# Altium project SmartHeat_Water_control.PrjPcb
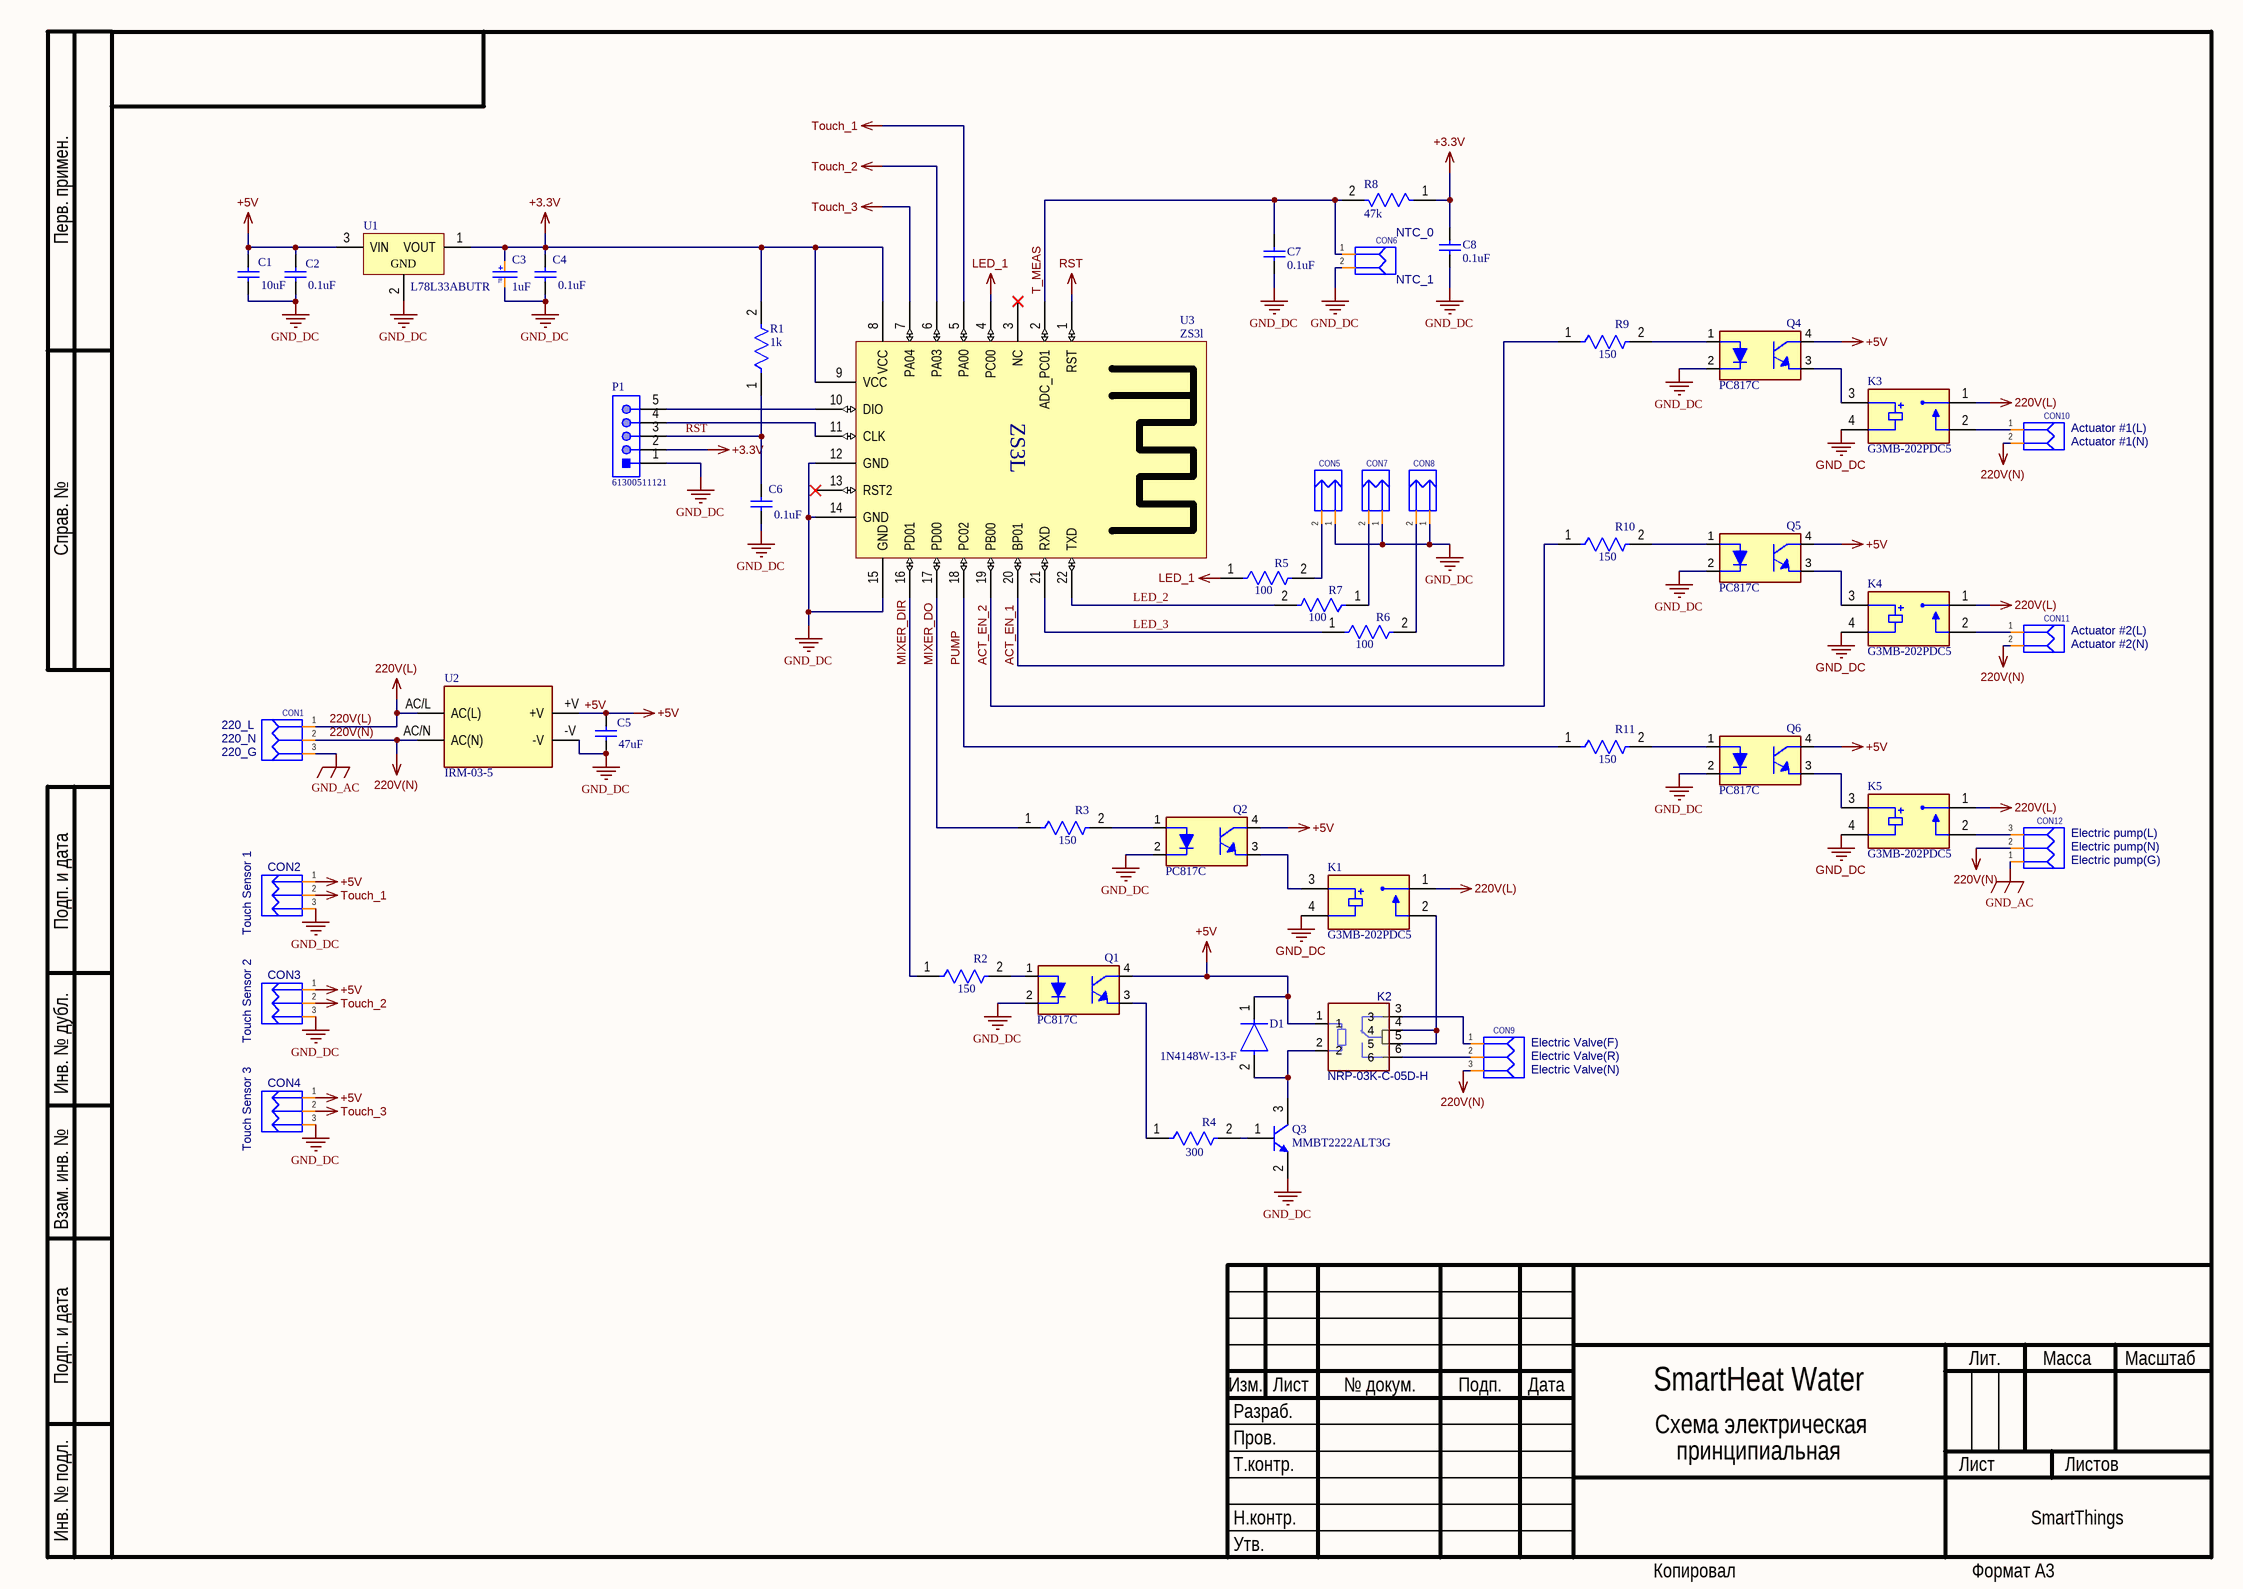
[diagram p0: Схема принципиальная.SchDoc]
1 sheet, 47 parts. Net scope: global (net labels, ports and power ports of the same name join across sheets).
Board file: Плата печатная2.PcbDoc

## Sheet Схема принципиальная.SchDoc
size 420 x 297 mm; Наименование организации: SmartThings; Наименование изделия 1: SmartHeat Water; Наименование изделия 2: Схема электрическая; Наименование изделия 3: принципиальная

### Parts
C1  10uF  [CAPC2013X135X45ML10T25]
C2  0.1uF  [CAPC2013X140X45NL15T25]
C3  1uF  [TANTAL_B]
C4  0.1uF  [CAPC2013X140X45NL15T25]
C5  47uF  [MURA-1210_H_2.7_L]
C6  0.1uF  [CAPC2013X140X45NL15T25]
C7  0.1uF  [CAPC2013X140X45NL15T25]
C8  0.1uF  [CAPC2013X140X45NL15T25]
CON1  DG129-5.08-3  [DG129-5.08-3]  (value not drawn)
CON2  PLS-03  [PLS-03]  (value not drawn)
CON3  PLS-03  [PLS-03]  (value not drawn)
CON4  PLS-03  [PLS-03]  (value not drawn)
CON5  PLS-02  [PLS-02]  (value not drawn)
CON6  DG129-5.08-2  [DG129-5.08-2]  (value not drawn)
CON7  PLS-02  [PLS-02]  (value not drawn)
CON8  PLS-02  [PLS-02]  (value not drawn)
CON9  DG129-5.08-3  [DG129-5.08-3]  (value not drawn)
CON10  DG129-5.08-2  [DG129-5.08-2]  (value not drawn)
CON11  DG129-5.08-2  [DG129-5.08-2]  (value not drawn)
CON12  DG129-5.08-3  [DG129-5.08-3]  (value not drawn)
D1  1N4148W-13-F  [FP-SOD123-MFG]
K1  G3MB-202PDC5  [RELAY_G3MB-202PDC5]
K2  NRP-03K-C-05D-H  [NRP-03K-C-05D-H]
K3  G3MB-202PDC5  [RELAY_G3MB-202PDC5]
K4  G3MB-202PDC5  [RELAY_G3MB-202PDC5]
K5  G3MB-202PDC5  [RELAY_G3MB-202PDC5]
P1  61300511121  [61300511121]
Q1  PC817C  [DIP762W50P254L650H458Q4B]
Q2  PC817C  [DIP762W50P254L650H458Q4B]
Q3  MMBT2222ALT3G  [ONSC-SOT-23-3-318-08_V]
Q4  PC817C  [DIP762W50P254L650H458Q4B]
Q5  PC817C  [DIP762W50P254L650H458Q4B]
Q6  PC817C  [DIP762W50P254L650H458Q4B]
R1  1k  [FP-CR0805-IPC_C]
R2  150  [FP-CR0805-IPC_C]
R3  150  [FP-CR0805-IPC_C]
R4  300  [FP-CR0805-IPC_C]
R5  100  [FP-CR0805-IPC_C]
R6  100  [FP-CR0805-IPC_C]
R7  100  [FP-CR0805-IPC_C]
R8  47k  [FP-CRCW1206-e3-IPC_C]
R9  150  [FP-CR0805-IPC_C]
R10  150  [FP-CR0805-IPC_C]
R11  150  [FP-CR0805-IPC_C]
U1  L78L33ABUTR  [SOT-89_L]
U2  IRM-03-5  [footprint_IRM-03-5]
U3  ZS3l  [zs3l]

### Nets
220V(L): CON1.1 K1.1 K3.1 K4.1 K5.1 U2.AC/L(AC(L))
220V(N): CON1.2 CON9.3 CON10.2 CON11.2 CON12.2 U2.AC/N(AC(N))
+3.3V: C3.1 C4.2 C8.2 P1.2 R1.2 R8.1 U1.1(VOUT) U3.8(VCC) U3.9(VCC)
+5V: C1.2 C2.2 C5.2 CON2.1 CON3.1 CON4.1 D1.1(C) K2.1 Q1.4 Q2.4 Q4.4 Q5.4 Q6.4 U1.3(VIN) U2.+V
GND_AC: CON1.3 CON12.1
GND_DC: C1.1 C2.1 C3.2 C4.1 C5.1 C6.1 C7.1 C8.1 CON2.3 CON3.3 CON4.3 CON5.1 CON6.2 CON7.1 CON8.1 K1.4 K3.4 K4.4 K5.4 P1.1 Q1.2 Q2.2 Q3.2(E) Q4.2 Q5.2 Q6.2 U1.2(GND) U2.-V U3.12(GND) U3.14(GND) U3.15(GND)
LED_1: R5.1 U3.4(PC00)
RST: C6.2 P1.3 R1.1 U3.1(RST)
Touch_1: CON2.2 U3.5(PA00)
Touch_2: CON3.2 U3.6(PA03)
Touch_3: CON4.2 U3.7(PA04)
ACT_EN_1: R9.1 U3.20(BP01)
ACT_EN_2: R10.1 U3.19(PB00)
LED_2: R7.2 U3.22(TXD)
LED_3: R6.1 U3.21(RXD)
MIXER_DIR: R2.1 U3.16(PD01)
MIXER_DO: R3.1 U3.17(PD00)
PUMP: R11.1 U3.18(PC02)
T_MEAS: C7.2 CON6.1 R8.2 U3.2(ADC_PC01)
NetCON5_2: CON5.2 R5.2
NetCON7_2: CON7.2 R7.1
NetCON8_2: CON8.2 R6.2
NetCON9_1: CON9.1 K2.3
NetCON9_2: CON9.2 K2.6
NetCON10_1: CON10.1 K3.2
NetCON11_1: CON11.1 K4.2
NetCON12_3: CON12.3 K5.2
NetD1_2: D1.2(A) K2.2 Q3.3(C)
NetK1_2: K1.2 K2.4 K2.5
NetK1_3: K1.3 Q2.3
NetK3_3: K3.3 Q4.3
NetK4_3: K4.3 Q5.3
NetK5_3: K5.3 Q6.3
NetP1_4: P1.4 U3.11(CLK)
NetP1_5: P1.5 U3.10(DIO)
NetQ1_1: Q1.1 R2.2
NetQ1_3: Q1.3 R4.1
NetQ2_1: Q2.1 R3.2
NetQ3_1: Q3.1(B) R4.2
NetQ4_1: Q4.1 R9.2
NetQ5_1: Q5.1 R10.2
NetQ6_1: Q6.1 R11.2

Not connected (* = marked no-connect by the designer): U3 3(NC)* 13(RST2)*

### Notes on the sheet
- NTC_0
- (near CON6) NTC_1
- (near CON10) Actuator #1(L)
- (near CON10) Actuator #1(N)
- (near CON11) Actuator #2(L)
- (near CON11) Actuator #2(N)
- (near CON1) 220_L
- (near CON1) 220_N
- (near CON1) 220_G
- (near CON12) Electric pump(L)
- (near CON12) Electric pump(G)
- (near CON12) Electric pump(N)
- Touch Sensor 1
- Touch Sensor 2
- (near CON9) Electric Valve(F)
- (near CON9) Electric Valve(N)
- (near CON9) Electric Valve(R)
- Touch Sensor 3
- Перв. примен.
- Справ. №
- Подп. и дата
- Инв. № дубл.
- Взам. инв. №
- Разраб.
- Изм.
- Лист
- № докум.
- Подп.
- Дата
- Лит.
- Масса
- Масштаб
- Пров.
- Т.контр.
- Листов
- Инв. № подл.
- Утв.
- Н.контр.
- Копировал
- Формат А3
- (in symbol _TANTAL-B) TB
- (in symbol ZS3l) ZS3L

### Library data of the parts
C1 = CMP-2000-04946-1: GRM21BR61E106KA73L / 10uF, +/- 10%, 25 V, 0805; Manufacturer: Murata; Dielectric: X7R; Capacitance: 1µF; Rated Voltage: 16V; Package Description: 2-Pin Surface Mount Device, Body 2 x 1.25 mm; Datasheet Version: Mar-08; Package Reference: 805; Datasheet URL: https://datasheet.ciiva.com/34302/1858922-34302874.pdf; Case Size/Dimension: 0805; Tolerance (%): ±10%; Manufacturer URL: http://www.murata.com/
C2 C4 C6-C8 = CMP-2007-03401-1: GRM21BR71H104K / 0.1 мкФ X7R 10% 50В 0805; Part Number: GRM21BR71C475KA73L; Manufacturer: Murata
C3 = _TANTAL-B: TANTAL TECAP1/50V B, 10%; Note: Tantalum Capacitors; Lifetime @ Temp: 2000Hrs@105℃; Publisher: Catcatcat Electronics; website developer: http://catcatcat.d-lan.dp.ua/; Assembly type: Manual Part; Value: 1uF
C5 = CMP-2000-06362-1: Cap Ceramic, 47 uF, +/- 10%, -55 to 85 degC, 2-Pin SMD (1210), RoHS, Tape and Reel; Manufacturer: Murata; Catalog Drawings: GRMSeries_1210_2.5; Voltage Rating DC: 16V; Capacitance: 47µF; Product Training Modules: High-CapMultilayerCeramicCapacitors; Temperature Coefficient: X5R; Online Catalog: GRMSeries; Other Names: 490-6539-6; Lead Style: -; Datasheet URL: http://psearch.en.murata.com/capacitor/product/GRM32ER61C476KE15%23.pdf; Package Description: 2-Pin Surface Mount Device, Body 3.2 x 2.5 mm; Applications: GeneralPurpose; Thickness (Max): 0.106"(2.70mm); Operating Temperature: -55°C~85°C; Mounting Technology: SurfaceMount; Category: Capacitors; Package / Case: 1210(3225Metric); Mounting Type: SurfaceMount,MLCC; Ratings: -; Package Reference: 1210; Height - Seated (Max): -; Series: GRM; Lead Spacing: -; Family: CeramicCapacitors; Datasheet Version: 04/2016; Tolerance: ±10%; Size / Dimension: 0.126"Lx0.098"W(3.20mmx2.50mm); Packaging: Digi-Reel®; Voltage - Rated: 16V; Standard Package: 1; Features: -; Manufacturer URL: http://www.murata.com/
CON1 CON9 CON12 = DG129-5.08-3: Note: Connector; Temp.Characteristic: -40C to +85C; Value: *; Publisher: Catcatcat Electronics; Website developer: http://catcatcat.d-lan.dp.ua/; Assembly type: Manual Part
CON2-CON4 = PLS-03: 2.54 mm; Note: Connector; Temp.Characteristic: -40C to +85C; Value: *; Publisher: Catcatcat Electronics; Website developer: http://catcatcat.d-lan.dp.ua/; Assembly type: Manual Part
CON5 CON7 CON8 = PLS-02: 2.54 mm; Note: Connector; Temp.Characteristic: -40C to +85C; Value: *; Publisher: Catcatcat Electronics; Website developer: http://catcatcat.d-lan.dp.ua/; Assembly type: Manual Part
CON6 CON10 CON11 = DG129-5.08-2: Note: Connector; Temp.Characteristic: -40C to +85C; Value: *; Publisher: Catcatcat Electronics; Website developer: http://catcatcat.d-lan.dp.ua/; Assembly type: Manual Part
D1 = CMP-12791-000005-1: DIODE GEN PURP 100V 150MA SOD123; Manufacturer: Diodes Inc.; Capacitance: 2pF; Forward Current: 300mA; Max Junction Temp: +150°C; Value: 2pF; Standoff Height: 0mm; Peak Reverse Current: 1uA; Max Surge Forward Current: 1A; Category: Diode; Height: 1.45mm; ComponentLink2URL: https://upverter.com/datasheet/628e7d6fee5901eee6eef4567d1c3569f2cd3cde.pdf; Lead Free: Yes; ComponentLink2Description: Datasheet; Octopart: https://octopart.com/1n4148w-13-f-diodes+inc.-2359612; Temperature Range High: +150°C; Device Class L2: Diodes; Digikey Description: DIODE GEN PURP 100V 150MA SOD123; Reverse Voltage: 100V; Temperature Range Low: -65°C; Device Class L1: Discrete Semiconductors; Package: SOD123; RoHS: TRUE; Manufacturer Part Number: 1N4148W-13-F; Footprint Url: https://www.diodes.com/assets/Package-Files/SOD123.pdf; Automotive: No; Max Repetitive Reverse Voltage: 100V; Mouser Description: 1N4148W Series 2 A 100 V 400 mW Surface Mount Fast Switching Diode - SOD-123; Temperature: -65°C to +150°C; Device Class L3: Rectifier Diodes
K1 K3-K5 = G3MB-202PDC5: MF: {'manufacturer': u'Omron Automation'}; Package: None; MP: G3MB-202PDC5; Value: *; Price: None; Availability: Unavailable
P1 = CMP-1502-01068-1: THT Vertical Pin Header WR-PHD, Pitch 2.54 mm, Single Row, 5 pins; Manufacturer: Wurth Elektronik; Pin Number: 5; Contact Resistance: 20mOhm; Working Voltage: 250VAC; Pitch: 2.54mm; Withstanding Voltage: 500VAC; Rated Current: 3A; Gender: Male; Datasheet URL: https://katalog.we-online.de/em/datasheet/6130xx11121.pdf; Orientation: Vertical; Mounting Technology: THT; Row Number: Single; Package Reference: 61300511121; Publisher: WurthElektronik; Part Number: 61300511121; Packaging: Bag; Manufacturer URL: http://www.we-online.de; Operating Temperature: -40to105degC
Q1 Q2 Q4-Q6 = PC817C: High Density Mounting Type Photocoupler; MF: {'manufacturer': u'Taiwan Semiconductor'}; Package: None; MP: PC817C; Value: *; Price: None; Availability: Unavailable
Q3 = CMP-1048-00592-1: General Purpose Transistor, NPN Silicon, 3-Pin SOT-23, Pb-Free, Tape and Reel; Manufacturer: On Semiconductor; fT Min (MHz): 300; IC Continuous (A): 0.6; PackageReference: SOT-23-3-318-08; ComponentLink3URL: http://www.onsemi.cn/pub_link/Collateral/318-08.PDF; DatasheetVersion: Rev. 10; Packing: Tape and Reel; Mounting Technology: Surface Mount; ComponentLink2Description: Datasheet; ComponentLink1URL: http://www.onsemi.com/; ComponentLink2URL: http://www.onsemi.cn/pub_link/Collateral/MMBT2222LT1-D.PDF; PackageVersion: Rev. AP, 11/2009; PartNumber: MMBT2222ALT3G; RoHS: TRUE; PackageDescription: 3-Pin Small Outline Transistor, Body 2.92 x 1.3 mm, Pitch 0.95 mm; ComponentLink3Description: Package Specification; Polarity: NPN; ComponentLink1Description: Manufacturer URL
R1-R3 R5-R7 R9-R11 = CMP-07231-005922-1: 0805 150Ω 0.125W 1%; Power Rating: 125mW; Voltage Rating: 150V; Temperature Coefficient: 100ppm/°C; Resistance: 300kR; Max Power Dissipation: 125mW; Tolerance: 1%; Radiation Hardening: No; Max Operating Temperature: 155°C; Contact Plating: Tin; Length: 2mm; Military Standard: Not; Depth: 1.25mm; Min Operating Temperature: -55°C; Package Quantity: 1; Number of Terminations: 2; Composition: Thick Film; Packaging: Tape and Reel; Mount: Surface Mount; Case/Package: 0805; Thickness: 508um; Case Code (Imperial): 0805; Features: Moisture Resistant; Case Code (Metric): 2012; Width: 0.049inch; Height: 0.024inch; Termination: SMD/SMT
R4 = CMP-07231-005922-1: 0805 300kΩ 0.125W 1%; Power Rating: 125mW; Voltage Rating: 150V; Temperature Coefficient: 100ppm/°C; Resistance: 300kR; Max Power Dissipation: 125mW; Tolerance: 1%; Radiation Hardening: No; Max Operating Temperature: 155°C; Contact Plating: Tin; Length: 2mm; Military Standard: Not; Depth: 1.25mm; Min Operating Temperature: -55°C; Package Quantity: 1; Number of Terminations: 2; Composition: Thick Film; Packaging: Tape and Reel; Mount: Surface Mount; Case/Package: 0805; Thickness: 508um; Case Code (Imperial): 0805; Features: Moisture Resistant; Case Code (Metric): 2012; Width: 0.049inch; Height: 0.024inch; Termination: SMD/SMT
R8 = CMP-2003-04807-2: 10kΩ, 1%, 0.25W 1206; Working Voltage: 200V; Max Power Dissipation: 250mW; Resistance: 10kR; Temperature Coefficient: 100ppm/°C; Tolerance: 1%; Width: 0.063inch; Height: 0.55mm; Number of Pins: 2; Voltage Rating: 200V; Military Standard: Not; Features: Automotive AEC-Q200; Depth: 1.6mm; Radiation Hardening: No; Termination: SMD/SMT; Case Code (Imperial): 1206; Weight: 0.000353oz; Length: 3.2mm; Package Quantity: 10; Voltage Rating (DC): 200V; Case/Package: 1206; Min Operating Temperature: -55°C; Number of Terminations: 2; Composition: Thick Film; Contact Plating: Tin; Power Rating: 250mW; Packaging: Tape and Reel; Max Operating Temperature: 155°C; Lead Free: Lead Free; Case Code (Metric): 3216
U1 = CMP-0244-00410-1: Positive Voltage Regulator, 3.3V, 4-Pin SOT-89, Tape and Reel https://www.chipdip.ru/product/l78l33abutr; ComponentLink2Description: Datasheet; ComponentLink2URL: http://www.st.com/internet/com/TECHNICAL_RESOURCES/TECHNICAL_LITERATURE/DATASHEET/CD00000446.pdf; DatasheetVersion: 1/02/2011; ComponentLink1Description: Manufacturer URL; PackageVersion: 2011; ComponentLink1URL: https://www.chipdip.ru/product/l78l33abutr; PackageReference: SOT-89; PackageDescription: 3-Pin SOT-89 Package 1.5 mm Pitch, 4.1 mm Lead Span
U2 = IRM-03-5: AC-DC Single output Encapsulated power supply; Output 5Vdc at 0.6A; PCB mount, miniature size; MF: {'manufacturer': u'MEAN WELL'}; Package: None; MP: IRM-03-5; Price: None; Value: *; Availability: Unavailable
U3 = ZS3l: ZS3L module on chip EFR32MG21A020F768IM32